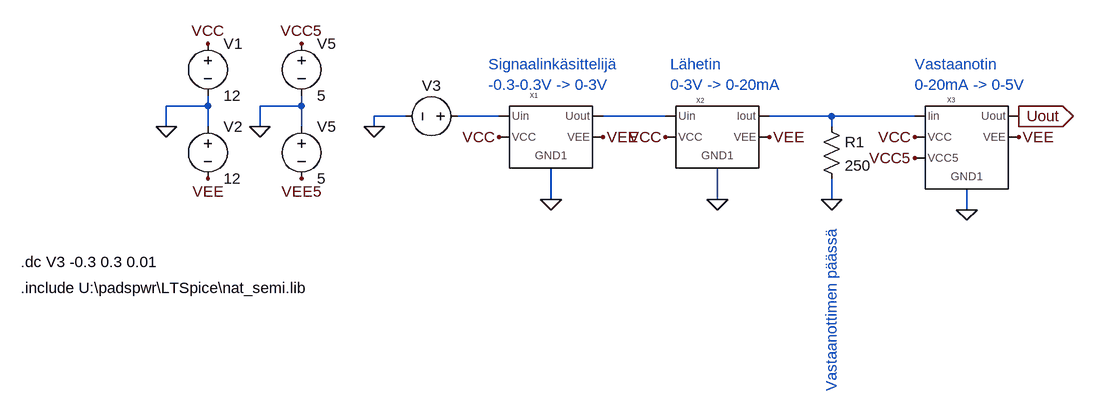
[diagram p0: schematic Lämpötila-anturi.asc]
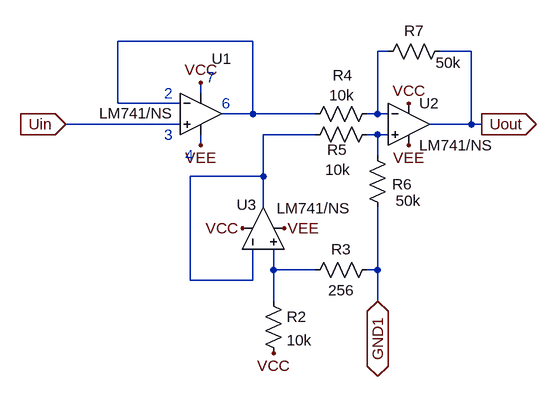
[diagram p1: sub-circuit 1signaalinkäsittelijä.asc]
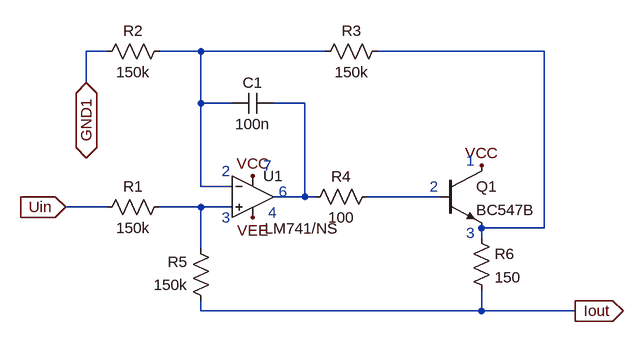
[diagram p2: sub-circuit 2viestinvalitys_lahetin.asc]
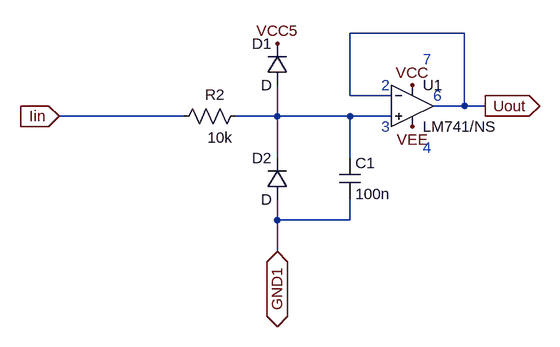
[diagram p3: sub-circuit 2viestinvalitys_vastaanotin.asc]
Lämpötila-anturi.asc, the LTspice schematic file:
Version 4.1
SHEET 1 1124 680
WIRE -240 160 -240 144
WIRE -240 160 -304 160
WIRE -96 160 -96 144
WIRE -96 160 -160 160
WIRE 64 176 16 176
WIRE 208 176 144 176
WIRE 464 176 368 176
WIRE 720 176 624 176
WIRE 848 176 720 176
WIRE -304 192 -304 160
WIRE -240 192 -240 160
WIRE -160 192 -160 160
WIRE -96 192 -96 160
WIRE 16 192 16 176
WIRE 720 192 720 176
WIRE 288 304 288 256
WIRE 544 304 544 256
WIRE 720 304 720 272
WIRE 928 320 928 288
FLAG -304 192 0
FLAG -240 64 VCC
FLAG -240 272 VEE
FLAG 16 192 0
FLAG 208 208 VCC
FLAG 368 208 VEE
FLAG 288 304 0
FLAG -160 192 0
FLAG -96 64 VCC5
FLAG -96 272 VEE5
FLAG 464 208 VCC
FLAG 624 208 VEE
FLAG 544 304 0
FLAG 720 304 0
FLAG 848 208 VCC
FLAG 1008 208 VEE
FLAG 848 240 VCC5
FLAG 1008 176 Uout
IOPIN 1008 176 Out
FLAG 928 320 0
SYMBOL voltage -240 48 R0
SYMATTR InstName V1
SYMATTR Value 12
SYMBOL voltage -240 176 R0
SYMATTR InstName V2
SYMATTR Value 12
SYMBOL voltage 160 176 R90
WINDOW 0 -32 56 VBottom 2
WINDOW 3 32 56 VTop 2
SYMATTR InstName V3
SYMATTR Value ""
SYMBOL 1Signaalinkäsittelijä 288 176 R0
SYMATTR InstName X1
SYMBOL voltage -96 48 R0
SYMATTR InstName V5
SYMATTR Value 5
SYMBOL voltage -96 176 R0
SYMATTR InstName V5
SYMATTR Value 5
SYMBOL 2Viestinvalitys_lahetin 544 176 R0
SYMATTR InstName X2
SYMBOL res 704 176 R0
SYMATTR InstName R1
SYMATTR Value 250
SYMBOL 2Viestinvalitys_vastaanotin 928 176 R0
SYMATTR InstName X3
TEXT -528 400 Left 2 !.dc V3 -0.3 0.3 0.01
TEXT -528 440 Left 2 !.include U:\\padspwr\\LTSpice\\nat_semi.lib
TEXT 192 96 Left 2 ;Signaalinkäsittelijä\n-0.3-0.3V -> 0-3V
TEXT 472 96 Left 2 ;Lähetin\n0-3V -> 0-20mA
TEXT 848 96 Left 2 ;Vastaanotin\n0-20mA -> 0-5V
TEXT 720 600 VLeft 2 ;Vastaanottimen päässä

1signaalinkäsittelijä.asc, the sub-circuit schematic file:
Version 4.1
SHEET 1 888 680
WIRE 208 48 0 48
WIRE 416 64 400 64
WIRE 544 64 496 64
WIRE 128 128 128 112
WIRE 0 144 0 48
WIRE 96 144 0 144
WIRE 208 160 208 48
WIRE 208 160 160 160
WIRE 304 160 208 160
WIRE 400 160 400 64
WIRE 400 160 384 160
WIRE 416 160 400 160
WIRE 96 176 -80 176
WIRE 544 176 544 64
WIRE 544 176 480 176
WIRE 560 176 544 176
WIRE 304 192 224 192
WIRE 400 192 384 192
WIRE 416 192 400 192
WIRE 128 208 128 192
WIRE 400 224 400 192
WIRE 224 256 224 192
WIRE 224 256 112 256
WIRE 224 304 224 256
WIRE 240 400 240 368
WIRE 304 400 240 400
WIRE 400 400 400 304
WIRE 400 400 384 400
WIRE 112 416 112 256
WIRE 208 416 208 368
WIRE 208 416 112 416
WIRE 240 448 240 400
WIRE 400 448 400 400
FLAG 128 112 VCC
FLAG 128 208 VEE
FLAG 192 336 VCC
FLAG 448 144 VCC
FLAG 256 336 VEE
FLAG 448 208 VEE
FLAG 240 528 VCC
FLAG 560 176 Uout
IOPIN 560 176 Out
FLAG -80 176 Uin
IOPIN -80 176 In
FLAG 400 448 GND1
IOPIN 400 448 BiDir
SYMBOL Opamps\\opamp2 160 336 R270
WINDOW 0 36 23 VRight 2
WINDOW 3 31 199 VLeft 2
SYMATTR InstName U3
SYMATTR Value LM741/NS
SYMBOL Opamps\\opamp2 448 112 R0
SYMATTR InstName U2
SYMATTR Value LM741/NS
SYMBOL Opamps\\opamp2 128 96 R0
WINDOW 3 -156 63 Left 2
WINDOW 0 17 -21 Left 2
SYMATTR Value LM741/NS
SYMATTR InstName U1
SYMBOL res 224 432 R0
SYMATTR InstName R2
SYMATTR Value 10k
SYMBOL res 400 384 R90
WINDOW 0 0 56 VBottom 2
WINDOW 3 32 56 VTop 2
SYMATTR InstName R3
SYMATTR Value 256
SYMBOL res 400 144 R90
WINDOW 0 -28 54 VBottom 2
WINDOW 3 -28 55 VTop 2
SYMATTR InstName R4
SYMATTR Value 10k
SYMBOL res 400 176 R90
WINDOW 0 55 62 VBottom 2
WINDOW 3 54 61 VTop 2
SYMATTR InstName R5
SYMATTR Value 10k
SYMBOL res 416 320 R180
WINDOW 0 -37 52 Left 2
WINDOW 3 -51 26 Left 2
SYMATTR InstName R6
SYMATTR Value 50k
SYMBOL res 400 80 R270
WINDOW 0 32 56 VTop 2
WINDOW 3 14 109 VBottom 2
SYMATTR InstName R7
SYMATTR Value 50k
TEXT 72 128 Left 2 ;2
TEXT 72 192 Left 2 ;3
TEXT 160 144 Left 2 ;6
TEXT 136 104 Left 2 ;7
TEXT 104 224 Left 2 ;4

2viestinvalitys_lahetin.asc, the sub-circuit schematic file:
Version 4.1
SHEET 1 1164 680
WIRE 144 -80 112 -80
WIRE 288 -80 224 -80
WIRE 480 -80 288 -80
WIRE 816 -80 560 -80
WIRE 112 -32 112 -80
WIRE 288 0 288 -80
WIRE 336 0 288 0
WIRE 448 0 400 0
WIRE 288 128 288 0
WIRE 336 128 288 128
WIRE 448 144 448 0
WIRE 448 144 400 144
WIRE 464 144 448 144
WIRE 656 144 544 144
WIRE 144 160 80 160
WIRE 288 160 224 160
WIRE 336 160 288 160
WIRE 816 192 816 -80
WIRE 816 192 720 192
WIRE 720 208 720 192
WIRE 288 224 288 160
WIRE 288 320 288 304
WIRE 720 320 720 288
WIRE 720 320 288 320
WIRE 864 320 720 320
FLAG 80 160 Uin
IOPIN 80 160 In
FLAG 368 112 VCC
FLAG 720 96 VCC
FLAG 368 176 VEE
FLAG 864 320 Iout
IOPIN 864 320 Out
FLAG 112 -32 GND1
IOPIN 112 -32 BiDir
SYMBOL res 240 144 R90
WINDOW 0 0 56 VBottom 2
WINDOW 3 32 56 VTop 2
SYMATTR InstName R1
SYMATTR Value 150k
SYMBOL OpAmps\\opamp2 368 80 R0
WINDOW 3 18 113 Left 2
SYMATTR Value LM741/NS
SYMATTR InstName U1
SYMBOL cap 400 -16 R90
WINDOW 0 0 32 VBottom 2
WINDOW 3 32 32 VTop 2
SYMATTR InstName C1
SYMATTR Value 100n
SYMBOL res 240 -96 R90
WINDOW 0 0 56 VBottom 2
WINDOW 3 32 56 VTop 2
SYMATTR InstName R2
SYMATTR Value 150k
SYMBOL res 576 -96 R90
WINDOW 0 0 56 VBottom 2
WINDOW 3 32 56 VTop 2
SYMATTR InstName R3
SYMATTR Value 150k
SYMBOL res 560 128 R90
WINDOW 0 0 56 VBottom 2
WINDOW 3 32 56 VTop 2
SYMATTR InstName R4
SYMATTR Value 100
SYMBOL res 304 320 R180
WINDOW 0 36 76 Left 2
WINDOW 3 36 40 Left 2
SYMATTR InstName R5
SYMATTR Value 150k
SYMBOL npn 656 96 R0
SYMATTR InstName Q1
SYMATTR Value BC547B
SYMBOL res 704 192 R0
SYMATTR InstName R6
SYMATTR Value 150
TEXT 320 104 Left 2 ;2
TEXT 320 176 Left 2 ;3
TEXT 408 136 Left 2 ;6
TEXT 384 96 Left 2 ;7
TEXT 392 168 Left 2 ;4
TEXT 640 128 Left 2 ;2
TEXT 696 200 Left 2 ;3
TEXT 696 88 Left 2 ;1

2viestinvalitys_vastaanotin.asc, the sub-circuit schematic file:
Version 4.1
SHEET 1 900 680
WIRE 752 0 576 0
WIRE 576 96 576 0
WIRE 640 96 576 96
WIRE 752 112 752 0
WIRE 752 112 704 112
WIRE 784 112 752 112
WIRE 320 128 128 128
WIRE 464 128 464 80
WIRE 464 128 400 128
WIRE 576 128 464 128
WIRE 640 128 576 128
WIRE 464 192 464 128
WIRE 576 192 576 128
WIRE 464 288 464 256
WIRE 576 288 576 256
WIRE 576 288 464 288
WIRE 464 336 464 288
FLAG 128 128 Iin
IOPIN 128 128 In
FLAG 672 80 VCC
FLAG 672 144 VEE
FLAG 464 16 VCC5
FLAG 784 112 Uout
IOPIN 784 112 Out
FLAG 464 336 GND1
IOPIN 464 336 BiDir
SYMBOL res 416 112 R90
WINDOW 0 -2 48 VBottom 2
WINDOW 3 33 40 VTop 2
SYMATTR InstName R2
SYMATTR Value 10k
SYMBOL diode 480 80 R180
WINDOW 0 24 64 Left 2
WINDOW 3 24 0 Left 2
SYMATTR InstName D1
SYMBOL diode 480 256 R180
WINDOW 0 24 64 Left 2
WINDOW 3 24 0 Left 2
SYMATTR InstName D2
SYMBOL cap 560 192 R0
SYMATTR InstName C1
SYMATTR Value 100n
SYMBOL OpAmps\\opamp2 672 48 R0
SYMATTR InstName U1
SYMATTR Value LM741/NS
TEXT 624 80 Left 2 ;2
TEXT 624 144 Left 2 ;3
TEXT 688 40 Left 2 ;7
TEXT 704 96 Left 2 ;6
TEXT 688 176 Left 2 ;4

The netlist it stands for:
* Lämpötila-anturi.asc
V1 VCC 0 12
V2 0 VEE 12
V3 N001 0
X§X1 N001 N002 0 VCC VEE 1signaalinkäsittelijä
V5 VCC5 0 5
V5 0 VEE5 5
X§X2 N002 N003 VCC VEE 0 2viestinvalitys_lahetin
R1 N003 0 250
X§X3 N003 Uout VCC VEE 0 VCC5 2viestinvalitys_vastaanotin

* block symbol definitions
.subckt 1signaalinkäsittelijä Uin Uout GND1 VCC VEE
X§U3 N005 N003 VCC VEE N003 LM741/NS  ; pins In+ In- V+ V- OUT
X§U2 N004 N002 VCC VEE Uout LM741/NS  ; pins In+ In- V+ V- OUT
X§U1 Uin N001 VCC VEE N001 LM741/NS  ; pins In+ In- V+ V- OUT
R2 N005 VCC 10k
R3 GND1 N005 256
R4 N002 N001 10k
R5 N004 N003 10k
R6 GND1 N004 50k
R7 N002 Uout 50k
* 2
* 3
* 6
* 7
* 4
.ends 1signaalinkäsittelijä

.subckt 2viestinvalitys_lahetin Uin Iout VCC VEE GND1
R1 N005 Uin 150k
X§U1 N005 N001 VCC VEE N003 LM741/NS  ; pins In+ In- V+ V- OUT
C1 N003 N001 100n
R2 N001 GND1 150k
R3 N002 N001 150k
R4 N004 N003 100
R5 Iout N005 150k
Q1 VCC N004 N002 0 BC547B
R6 N002 Iout 150
* 2
* 3
* 6
* 7
* 4
* 2
* 3
* 1
.ends 2viestinvalitys_lahetin

.subckt 2viestinvalitys_vastaanotin Iin Uout VCC VEE GND1 VCC5
R2 N001 Iin 10k
D1 N001 VCC5 D
D2 GND1 N001 D
C1 N001 GND1 100n
X§U1 N001 Uout VCC VEE Uout LM741/NS  ; pins In+ In- V+ V- OUT
* 2
* 3
* 7
* 6
* 4
.ends 2viestinvalitys_vastaanotin

.model D D
.lib standard.dio
.model NPN NPN
.model PNP PNP
.lib standard.bjt
.dc V3 -0.3 0.3 0.01
.include U:\padspwr\LTSpice\nat_semi.lib
* Signaalinkäsittelijä
* -0.3-0.3V -> 0-3V
* Lähetin
* 0-3V -> 0-20mA
* Vastaanotin
* 0-20mA -> 0-5V
* Vastaanottimen päässä
.backanno
.end